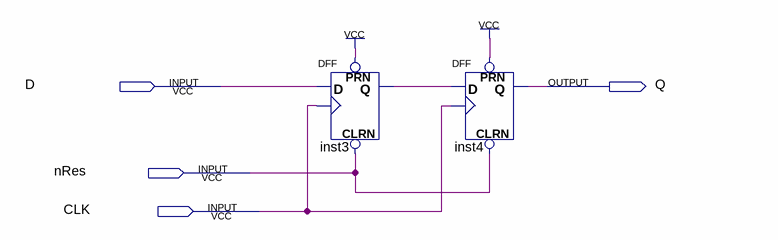
[diagram p0: schematic sheet]
// Quartus schematic SyncChain.bdf as structural Verilog: 2 symbols, 4 pins
module SyncChain (
  input  D,
  input  nRes,
  input  CLK,
  output Q
);

  wire inst3_q;

  DFF inst3 (.CLRN(nRes), .CLK(CLK), .D(D), .PRN(1'b1), .Q(inst3_q));
  DFF inst4 (.CLRN(nRes), .CLK(CLK), .D(inst3_q), .PRN(1'b1), .Q(Q));
endmodule
